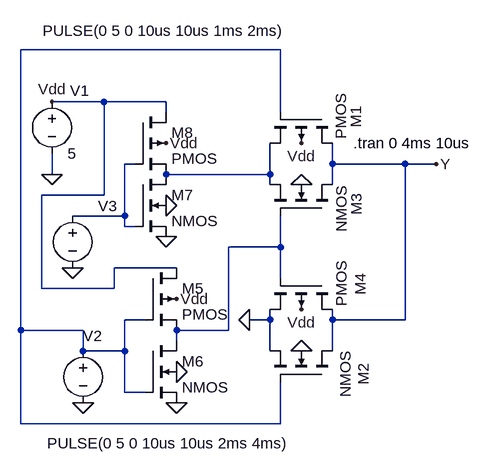
[diagram p0: schematic nor2tg.asc]
nor2tg.asc, the LTspice schematic file:
Version 4
SHEET 1 880 680
WIRE 176 -288 -224 -288
WIRE -96 -208 -176 -208
WIRE 0 -208 -96 -208
WIRE 0 -192 0 -208
WIRE 176 -192 176 -288
WIRE -48 -112 -64 -112
WIRE 256 -112 256 -144
WIRE 368 -112 256 -112
WIRE 416 -112 368 -112
WIRE -176 -96 -176 -128
WIRE 160 -96 160 -144
WIRE 160 -96 0 -96
WIRE 160 -80 160 -96
WIRE 256 -80 256 -112
WIRE -96 -64 -96 -208
WIRE -96 -64 -192 -64
WIRE -64 -32 -64 -112
WIRE -64 -32 -144 -32
WIRE -64 -16 -64 -32
WIRE -48 -16 -64 -16
WIRE 176 16 176 -32
WIRE 176 16 96 16
WIRE 16 48 -80 48
WIRE 176 64 176 16
WIRE -192 80 -192 -64
WIRE -80 80 -80 48
WIRE -80 80 -192 80
WIRE -32 128 -64 128
WIRE 160 128 160 112
WIRE 160 128 128 128
WIRE 256 128 256 112
WIRE 368 128 368 -112
WIRE 368 128 256 128
WIRE -224 144 -224 -288
WIRE -128 144 -224 144
WIRE 96 144 96 16
WIRE 96 144 16 144
WIRE 16 160 16 144
WIRE -128 176 -128 144
WIRE -64 176 -64 128
WIRE -64 176 -128 176
WIRE 160 176 160 128
WIRE 256 176 256 128
WIRE -64 240 -64 176
WIRE -32 240 -64 240
WIRE -224 288 -224 144
WIRE 176 288 176 224
WIRE 176 288 -224 288
FLAG 16 256 0
FLAG -128 256 0
FLAG -144 48 0
FLAG 416 -112 Y
FLAG 0 0 0
FLAG 16 208 0
FLAG -176 -208 Vdd
FLAG 0 -144 Vdd
FLAG 208 -144 Vdd
FLAG 208 112 Vdd
FLAG 16 96 Vdd
FLAG 208 -80 0
FLAG 208 176 0
FLAG 0 -48 0
FLAG 128 128 0
FLAG -176 -96 0
SYMBOL nmos4 256 -32 M270
WINDOW 0 1 -37 Left 2
WINDOW 3 -25 -14 Left 2
SYMATTR InstName M3
SYMBOL nmos4 256 224 M270
WINDOW 0 134 -43 Left 2
WINDOW 3 -24 -20 Left 2
SYMATTR InstName M4
SYMBOL pmos4 256 -192 R90
WINDOW 0 -9 -36 Left 2
WINDOW 3 -28 -13 Left 2
SYMATTR InstName M1
SYMBOL pmos4 256 64 R90
WINDOW 0 131 -48 Left 2
WINDOW 3 -27 -14 Left 2
SYMATTR InstName M2
SYMBOL pmos4 -32 48 R0
SYMATTR InstName M5
SYMBOL nmos4 -32 160 R0
SYMATTR InstName M6
SYMBOL voltage -176 -224 R0
WINDOW 123 0 0 Left 2
WINDOW 39 0 0 Left 2
WINDOW 0 28 -1 Left 2
SYMATTR InstName V1
SYMATTR Value 5
SYMBOL voltage -128 160 R0
WINDOW 123 0 0 Left 2
WINDOW 39 0 0 Left 2
WINDOW 0 0 -7 Left 2
WINDOW 3 -55 158 Left 2
SYMATTR InstName V2
SYMATTR Value PULSE(0 5 0 10us 10us 2ms 4ms)
SYMBOL nmos4 -48 -96 R0
SYMATTR InstName M7
SYMBOL pmos4 -48 -192 R0
SYMATTR InstName M8
SYMBOL voltage -144 -48 R0
WINDOW 123 0 0 Left 2
WINDOW 39 0 0 Left 2
WINDOW 0 39 1 Left 2
WINDOW 3 -46 -269 Left 2
SYMATTR InstName V3
SYMATTR Value PULSE(0 5 0 10us 10us 1ms 2ms)
TEXT 288 -144 Left 2 !.tran 0 4ms 10us

The netlist it stands for:
* nor2tg.asc
M3 Y N004 N003 0 NMOS
M4 Y N001 0 0 NMOS
M1 Y N001 N003 Vdd PMOS
M2 Y N004 0 Vdd PMOS
M5 Vdd N001 N004 Vdd PMOS
M6 N004 N001 0 0 NMOS
V1 Vdd 0 5
V2 N001 0 PULSE(0 5 0 10us 10us 2ms 4ms)
M7 N003 N002 0 0 NMOS
M8 Vdd N002 N003 Vdd PMOS
V3 N002 0 PULSE(0 5 0 10us 10us 1ms 2ms)
.model NMOS NMOS
.model PMOS PMOS
.lib standard.mos
.tran 0 4ms 10us
.backanno
.end